# EAGLE design UOF_proto_3V1 (EAGLE 9.5.2)
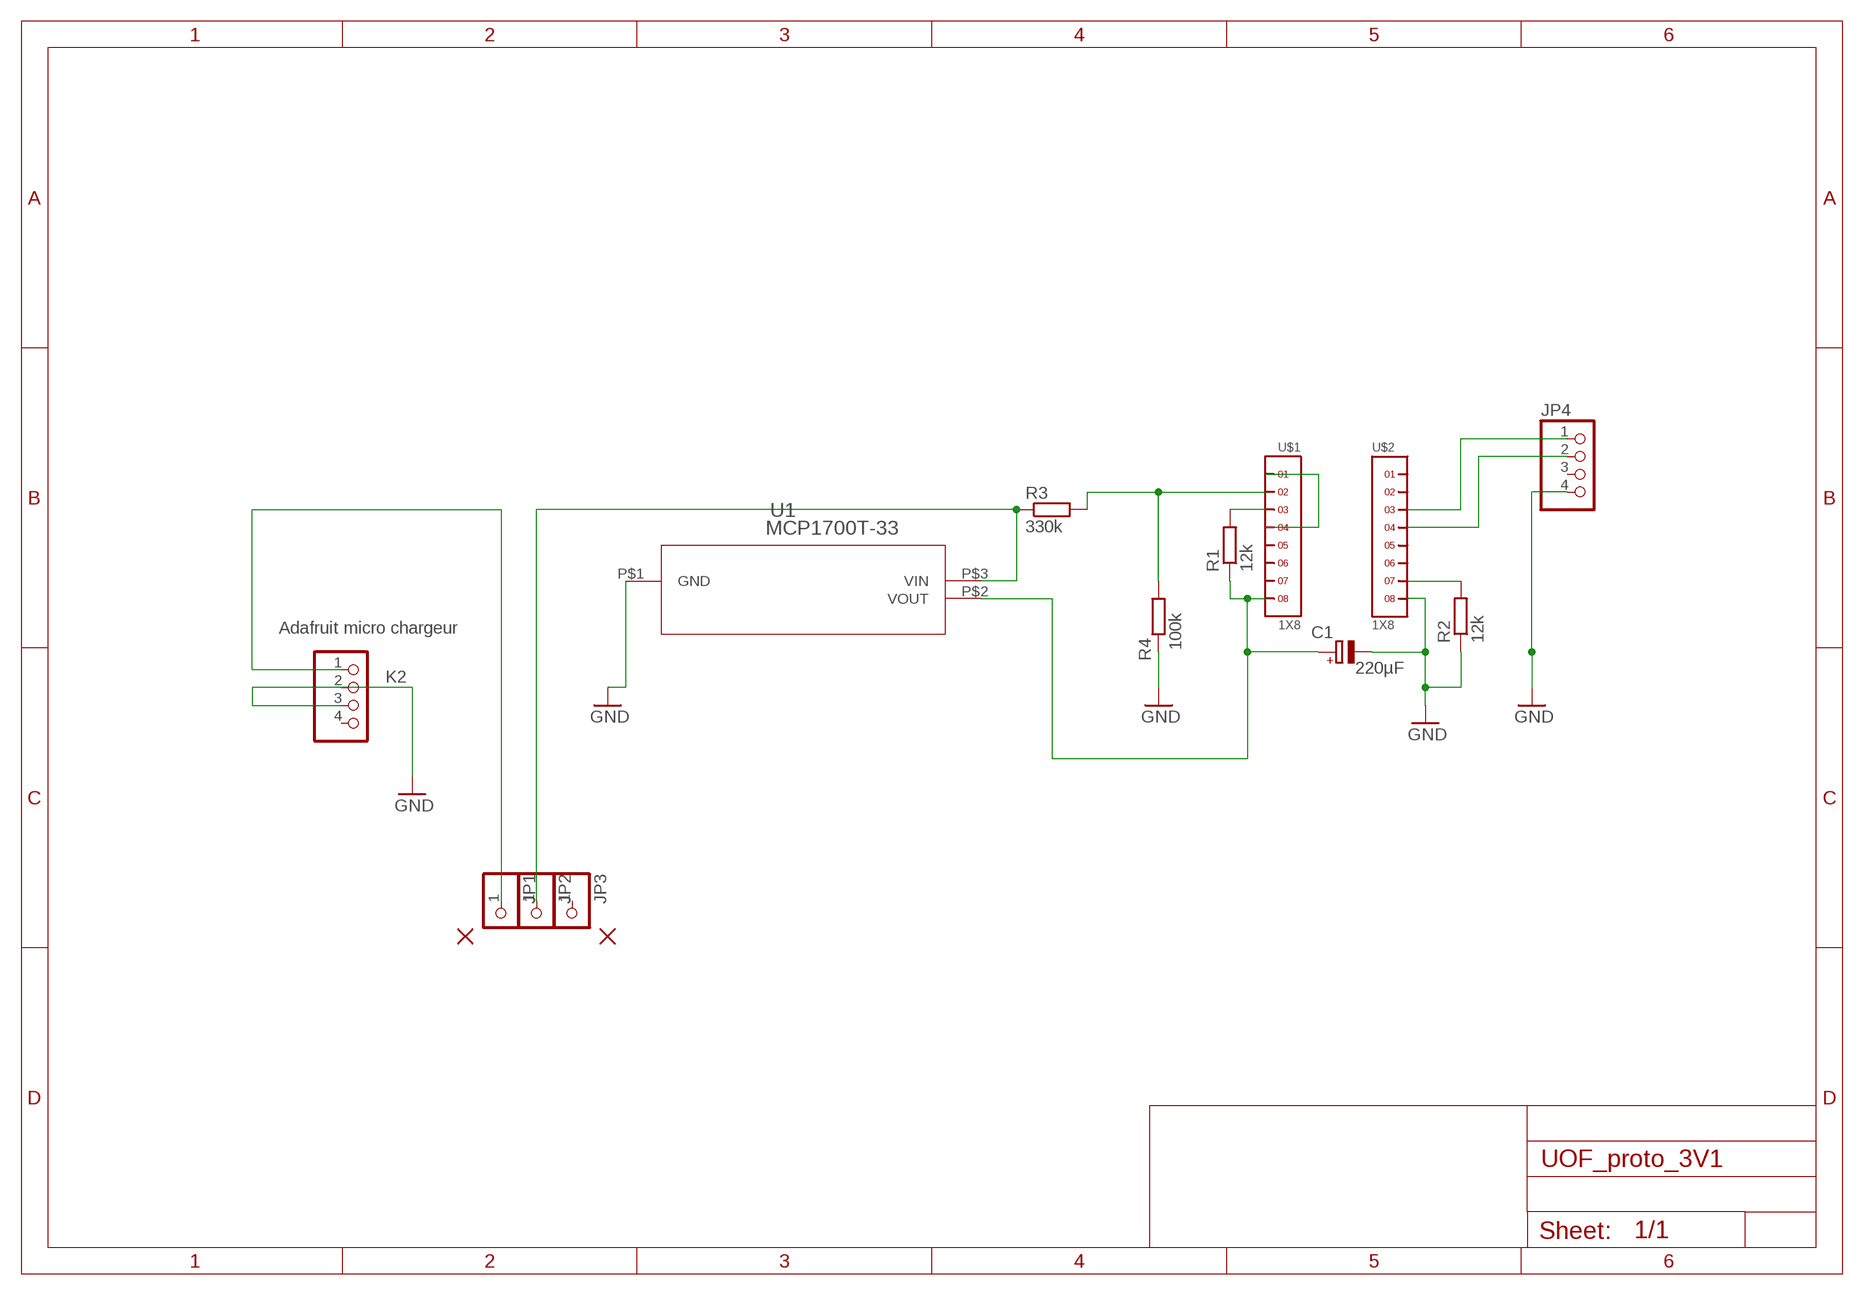
[diagram p0: schematic, sheet 1]

## Parts
C1  220µF  CPOL-EUE5-10.5  [E5-10,5]
JP1  PINHD-1X1  [1X01]
JP2  PINHD-1X1  [1X01]
JP3  PINHD-1X1  [1X01]
JP4  PINHD-1X4  [1X04]
K2  Adafruit micro chargeur  PINHD-1X4  [1X04]
PAD4  N_2,0/1,5  [2,0/1,5]
PAD5  N_2,0/1,5  [2,0/1,5]
R1  12k  R-EU_0207/10  [0207/10]
R2  12k  R-EU_0207/10  [0207/10]
R3  330k  R-EU_0207/10  [0207/10]
R4  100k  R-EU_0207/10  [0207/10]
U1  MCP1700T-33  MCP1700T-3302E/TTSOT-23  [SOT-23]
U$1  1X8  [1X8]
U$2  1X8  [1X8]

## Nets
GND: C1.- JP4.4 K2.2 K2.3 R2.1 R4.2 U1.P$1(GND) U$2.8
N$1: JP4.2 U$2.4
N$2: R3.2 R4.1 U$1.2
N$3: JP1.1 K2.1
N$4: R2.2 U$2.7
N$5: C1.+ R1.1 U1.P$2(VOUT) U$1.8
N$7: U$1.1 U$1.4
N$8: JP2.1 R3.1 U1.P$3(VIN)
N$9: R1.2 U$1.3
N$14: JP4.1 U$2.3
Unconnected: JP3.1 JP4.3 K2.4 U$1.5 U$1.6 U$1.7 U$2.1 U$2.2 U$2.5 U$2.6

## Library data of the parts
C1 = rcl:CPOL-EU: POLARIZED CAPACITOR, European symbol; SPICEPREFIX: C
JP1-JP3 = pinhead:PINHD-1X1: PIN HEADER
JP4 = _MCL_pinhead:PINHD-1X4: PIN HEADER
K2 = pinhead:PINHD-1X4: PIN HEADER
PAD4 PAD5 = _MCL_PADS:N_2,0/1,5
R1-R4 = rcl:R-EU_: RESISTOR, European symbol; SPICEPREFIX: R
U1 = MCP1700T-3302E:MCP1700T-3302E/TT
U$1 U$2 = headers(2mm):1X8

## Net classes
0 default: width 0.508 mm, clearance 0.508 mm

## Board
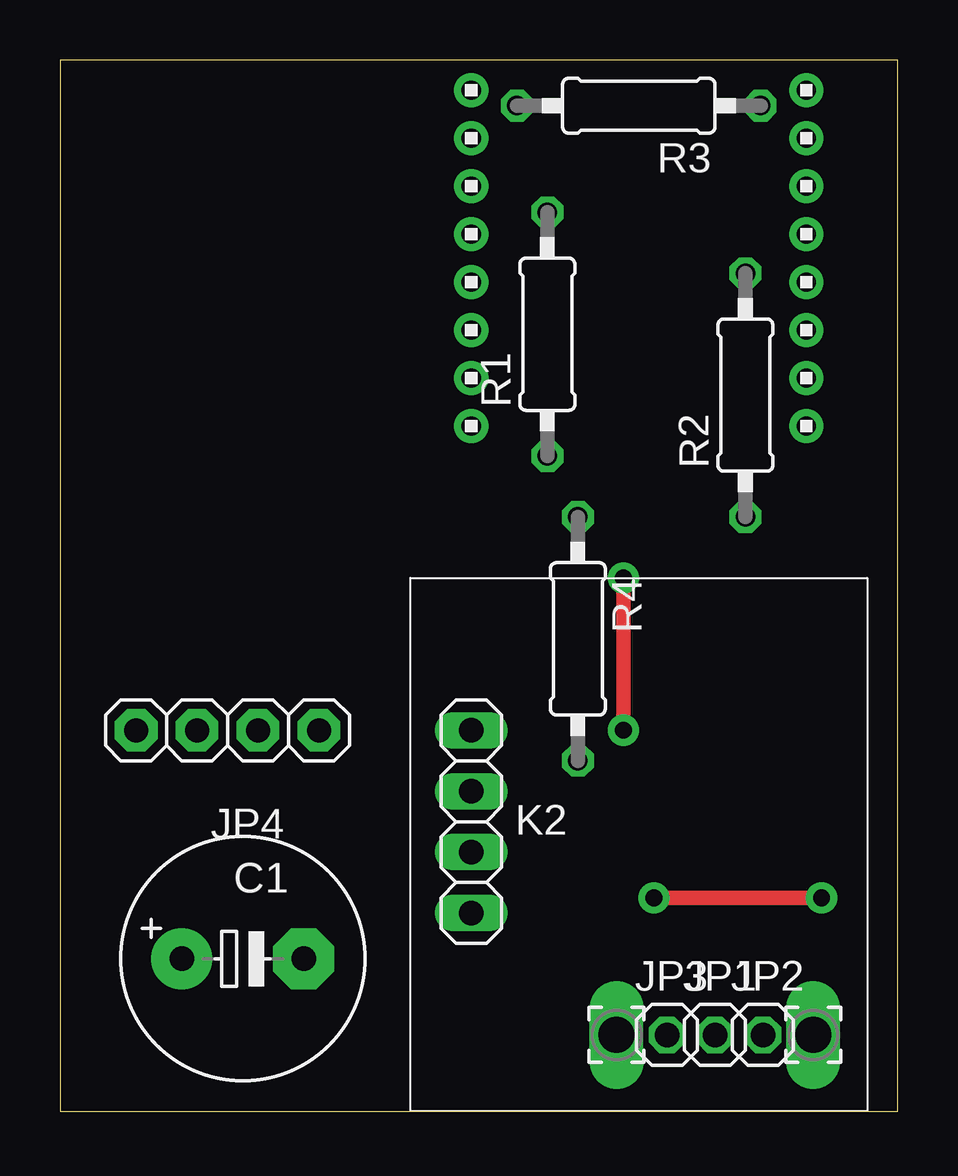
[diagram p1: board, top side]
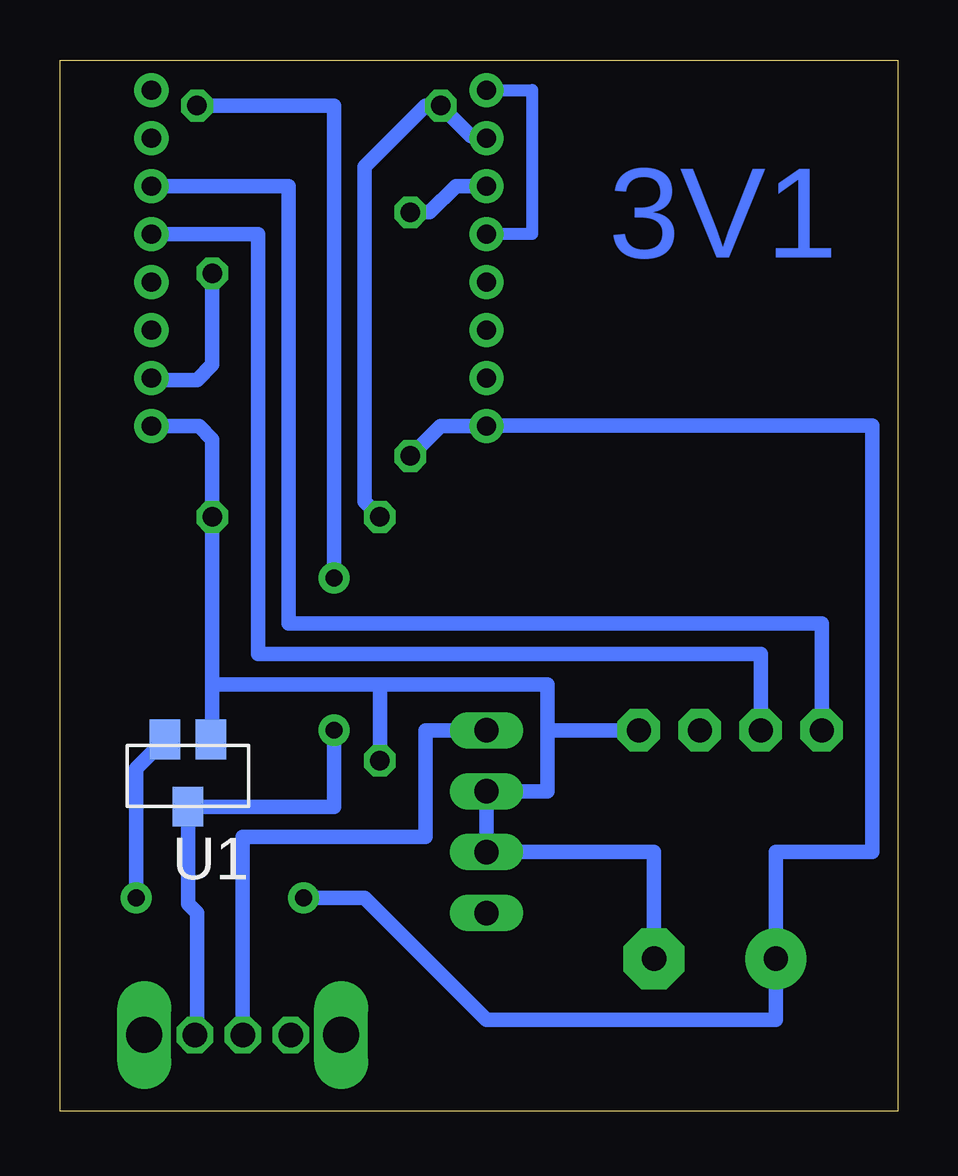
[diagram p2: board, bottom side, seen from below]

Size 34.92 x 43.81 mm. Coordinates in mm from the lower left corner, seen from the top.
Outline: 0,0 34.92,0 34.92,43.81 0,43.81 0,0
Copper layers (1*16): Top 0.035mm / dielectric 1.5mm / Bottom 0.035mm
Design rules "default": minimum track width 20mil, minimum drill 0.5mm, track to track 20mil, track to pad 20mil, pad to pad 20mil, via to via 20mil, smd to smd 20mil, copper to edge 30mil, drill to drill 20mil, minimum pad ring 10mil, minimum via ring 8mil, stop-mask expansion 4mil, vias tented up to drill 0mil, thermal gap 10mil

### Footprints (pad centres in the part's own frame; a part is rotated, then mirrored left to right if it is on the bottom)
E5-10,5 = drill 1.016 pad 2.54: + -2.54,0 | drill 1.016 pad 2.54 octagon: - 2.54,0
1X01 = drill 1.016 octagon: 1 0,0
1X04 = drill 1 pad 1.778 octagon: 1 -3.81,0; 2 -1.27,0; 3 1.27,0; 4 3.81,0
1X04' = drill 1.016 long: 1 -3.81,0; 2 -1.27,0; 3 1.27,0; 4 3.81,0
2,0/1,5 = drill 1.5 pad 2 long: 1 0,0
0207/10 = drill 0.813 octagon: 1 -5.08,0; 2 5.08,0
SOT-23 = smd 1.27 x 1.651: P$1 -0.95,-0.254; P$2 0.95,-0.254; P$3 0,2.554
1X8 = drill 0.8 pad 1.422: 1 -7,0; 2 -5,0; 3 -3,0; 4 -1,0; 5 1,0; 6 3,0; 7 5,0; 8 7,0

### Placement (x,y rotation side)
C1  7.62,6.35 0 top
JP1  27.3,3.17 0 top
JP2  29.3,3.17 0 top
JP3  25.3,3.17 0 top
JP4  6.99,15.88 0 top
K2  Adafruit micro chargeur  [1X04']  17.14,12.06 270 top
PAD4  23.2,3.17 90 top
PAD5  31.41,3.17 90 top
R1  20.32,32.38 90 top
R2  28.57,29.84 90 top
R3  24.13,41.91 180 top
R4  21.59,19.68 270 top
U1  29.59,15.24 180 bottom
U$1  17.14,35.56 270 top
U$2  31.11,35.56 270 top

### Tracks (layer width: path | path; a pad name or v marks a point on that pad's centre or on a via)
GND
  Bottom 0.61: 28.57,17.78 21.59,17.78 | 21.59,17.78 14.61,17.78 14.61,15.88 | U$2.8 29.13,28.56 28.57,27.99 R2.1 28.57,17.78 | 14.61,15.88 14.61,13.34 K2.2 K2.3 10.16,10.79 C1.- | JP4.4 14.61,15.88 | R4.2 21.59,17.78 | U1.P$1 28.57,15.49 28.57,17.78
N$1
  Bottom 0.61: JP4.2 5.71,19.05 26.67,19.05 26.67,36.56 U$2.4
N$2
  Bottom 0.61: U$1.2 17.23,40.64 17.78,40.64 R3.2 19.68,41.91 22.23,39.37 22.23,25.4 R4.1
N$3
  Bottom 0.61: K2.1 19.68,15.88 19.68,11.43 27.3,11.43 JP1.1
N$4
  Bottom 0.61: R2.2 28.57,31.11 29.21,30.48 31.04,30.48 U$2.7
N$5  (via drill 0.7 pad 1.3)
  Top 0.61: v24.77,8.89 v31.75,8.89
  Bottom 0.61: R1.1 19.07,28.56 U$1.8 17.14,28.57 1.07,28.57 1.07,10.79 5.08,10.79 C1.+ 5.08,3.81 17.14,3.81 22.23,8.89 v24.77,8.89 | U1.P$2 31.75,14.29 v31.75,8.89
N$7
  Bottom 0.508: U$1.1 15.24,42.56 15.24,36.56 U$1.4
N$8  (via drill 0.7 pad 1.3)
  Top 0.61: v23.5,22.23 v23.5,15.88
  Bottom 0.61: U1.P$3 29.3,12.59 | R3.1 23.5,41.91 v23.5,22.23 | U1.P$3 23.5,12.69 v23.5,15.88 | U1.P$3 29.59,8.64 29.21,8.26 29.21,3.27 JP2.1
N$9
  Bottom 0.61: U$1.3 18.41,38.56 19.51,37.47 R1.2
N$14
  Bottom 0.61: 31.11,38.73 U$2.3 25.4,38.56 25.4,20.32 3.17,20.32 JP4.1

### Text on the board
Bottom: 3V1